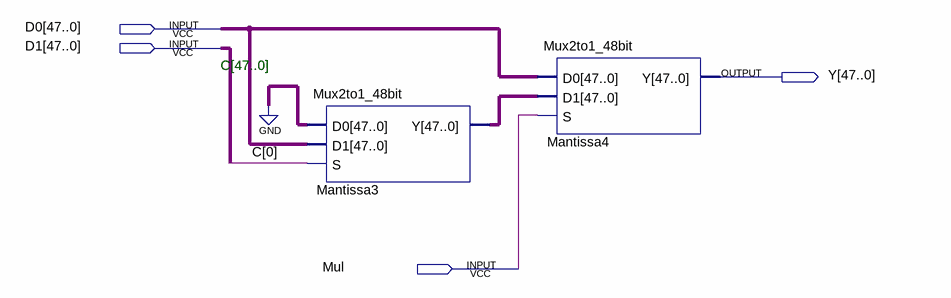
[diagram p0: schematic sheet]
// Quartus schematic ChonDauVaoALUNhan.bdf as structural Verilog: 2 symbols, 4 pins
module ChonDauVaoALUNhan (
  input  [47:0] D0,
  input  [47:0] D1,
  input  Mul,
  output [47:0] Y
);

  wire [47:0] Mantissa3_y;

  Mux2to1_48bit Mantissa3 (.D0({48{1'b0}}), .D1(D0), .S(D1[0]), .Y(Mantissa3_y));
  Mux2to1_48bit Mantissa4 (.D0(D0), .D1(Mantissa3_y), .S(Mul), .Y(Y));

  // Other names for the same wires on the sheet: C[47:0] = D1

  // Notes on the sheet:
  //   C[47..0]
endmodule
